# EAGLE design beeper (EAGLE 6.5.0)
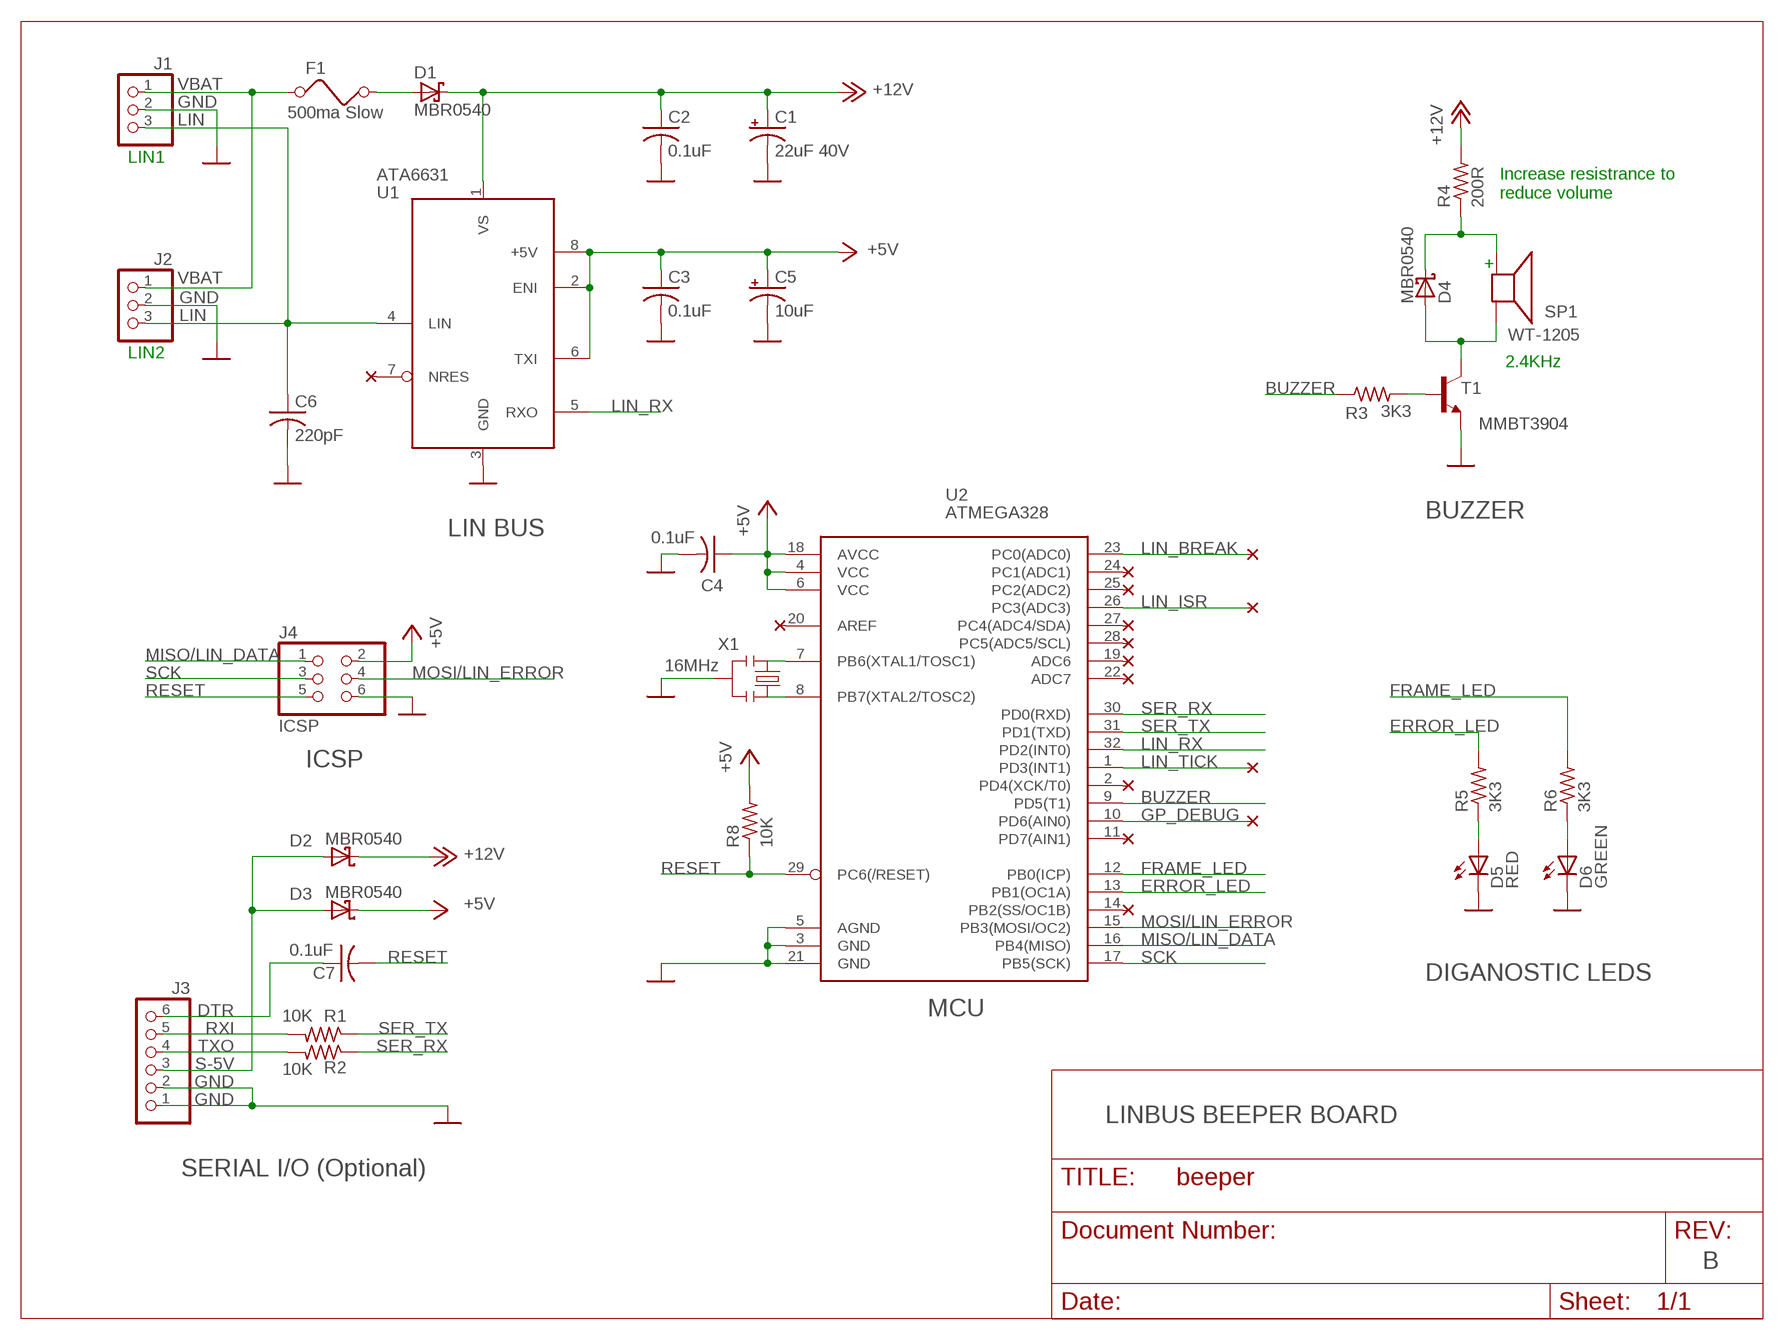
[diagram p0: schematic, sheet 1]

## Parts
C1  22uF 40V  CPOL-USUD-6,3X5,8  [UD-6,3X5,8_NICHICON]
C2  0.1uF  C-USC0805  [C0805]
C3  0.1uF  C-USC0805  [C0805]
C4  0.1uF  C-USC0805  [C0805]
C5  10uF  CPOL-USA/3216-18R  [A/3216-18R]
C6  220pF  C-USC0805  [C0805]
C7  0.1uF  C-USC0805  [C0805]
D1  MBR0540  SMF5.0AT1  [SOD123FL]
D2  MBR0540  SMF5.0AT1  [SOD123FL]
D3  MBR0540  SMF5.0AT1  [SOD123FL]
D4  MBR0540  SMF5.0AT1  [SOD123FL]
D5  RED  LED  [1206-LED]
D6  GREEN  LED  [1206-LED]
F1  500ma Slow  FUSE  [1206]
J1  PINHD-1X3  [1X03]
J2  PINHD-1X3  [1X03]
J3  PINHD-1X6  [1X06]
J4  ICSP  PINHD-2X3  [2X03]
R1  10K  R-US_R0805  [R0805]
R2  10K  R-US_R0805  [R0805]
R3  3K3  R-US_R0805  [R0805]
R4  200R  R-US_R0805  [R0805]
R5  3K3  R-US_R0805  [R0805]
R6  3K3  R-US_R0805  [R0805]
R8  10K  R-US_R0805  [R0805]
SP1  WT-1205  AL60P  [AL60P]
T1  MMBT3904  MMBT3904LT1-NPN-SOT23-BEC  [SOT23-BEC]
U1  ATA6631  [SO-08]
U2  ATMEGA328  [TQFP32-08]
X1  16MHz  RESONATORSMD  [RESONATOR-SMD]

## Nets
+5V: C3.1 C4.1 C5.+ D3.C J4.2 R8.2 U1.2(ENI) U1.6(TXI) U1.8(+5V) U2.4(VCC) U2.6(VCC) U2.18(AVCC)
+12V: C1.+ C2.1 D1.C D2.C R4.2 U1.1(VS)
BUZZER: R3.1 U2.9(PD5(T1))
DTR: C7.1 J3.6
ERROR_LED: R5.2 U2.13(PB1(OC1A))
FRAME_LED: R6.2 U2.12(PB0(ICP))
GND: C1.- C2.2 C3.2 C4.2 C5.- C6.2 D5.C D6.C J1.2 J2.2 J3.1 J3.2 J4.6 T1.E U1.3(GND) U2.3(GND) U2.5(AGND) U2.21(GND) X1.2
GP_DEBUG: U2.10(PD6(AIN0))
LIN: C6.1 J1.3 J2.3 U1.4(LIN)
LIN_BREAK: U2.23(PC0(ADC0))
LIN_ISR: U2.26(PC3(ADC3))
LIN_RX: U1.5(RXO) U2.32(PD2(INT0))
LIN_TICK: U2.1(PD3(INT1))
MISO/LIN_DATA: J4.1 U2.16(PB4(MISO))
MOSI/LIN_ERROR: J4.4 U2.15(PB3(MOSI/OC2))
N$3: D6.A R6.1
N$4: D5.A R5.1
N$6: D1.A F1.2
N$19: R3.2 T1.B
N$30: D4.C R4.1 SP1.1
N$31: D4.A SP1.2 T1.C
RESET: C7.2 J4.5 R8.1 U2.29(PC6(/RESET))
RXI: J3.5 R1.2
S-5V: D2.A D3.A J3.3
SCK: J4.3 U2.17(PB5(SCK))
SER_RX: R2.1 U2.30(PD0(RXD))
SER_TX: R1.1 U2.31(PD1(TXD))
TXO: J3.4 R2.2
VBAT: F1.1 J1.1 J2.1
XTAL1: U2.7(PB6(XTAL1/TOSC1)) X1.3
XTAL2: U2.8(PB7(XTAL2/TOSC2)) X1.1
Unconnected: U1.7(NRES) U2.2(PD4(XCK/T0)) U2.11(PD7(AIN1)) U2.14(PB2(SS/OC1B)) U2.19(ADC6) U2.20(AREF) U2.22(ADC7) U2.24(PC1(ADC1)) U2.25(PC2(ADC2)) U2.27(PC4(ADC4/SDA)) U2.28(PC5(ADC5/SCL))

## Notes on the sheet
- LIN1
- Increase resistrance to
  reduce volume
- +
- LIN2
- 2.4KHz
- BUZZER
- LIN BUS
- ICSP
- DIGANOSTIC LEDS
- MCU
- LINBUS BEEPER BOARD
- SERIAL I/O (Optional)
- B

## Library data of the parts
C1 C5 = beeper:CPOL-US
C2-C4 C6 C7 = beeper:C-US
D1-D4 = beeper:SMF5.0AT1
D5 D6 = beeper:LED
F1 = beeper:FUSE
J1 J2 = beeper:PINHD-1X3
J3 = beeper:PINHD-1X6
J4 = beeper:PINHD-2X3
R1-R6 R8 = beeper:R-US_
SP1 = beeper:AL60P; OC_FARNELL: unknown; OC_NEWARK: unknown
T1 = beeper:*-NPN-
U1 = beeper:ATA6631
U2 = beeper:ATMEGA328
X1 = beeper:RESONATOR

## Board
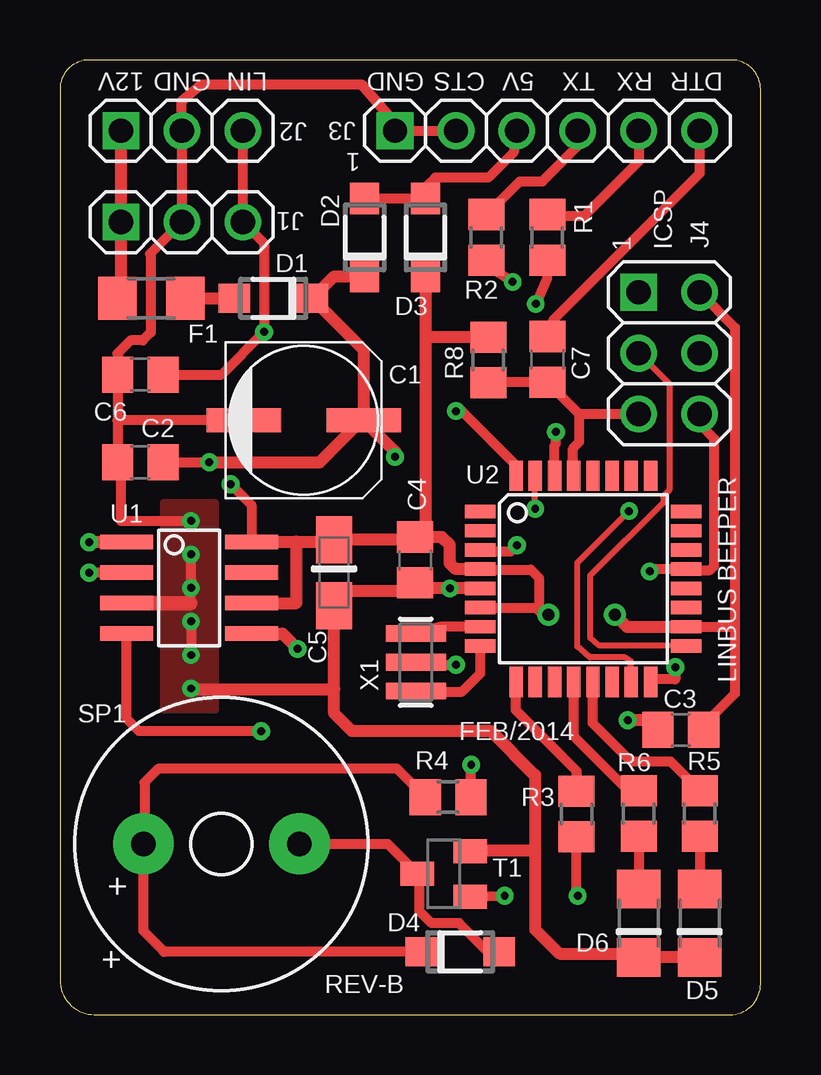
[diagram p1: board, top side]
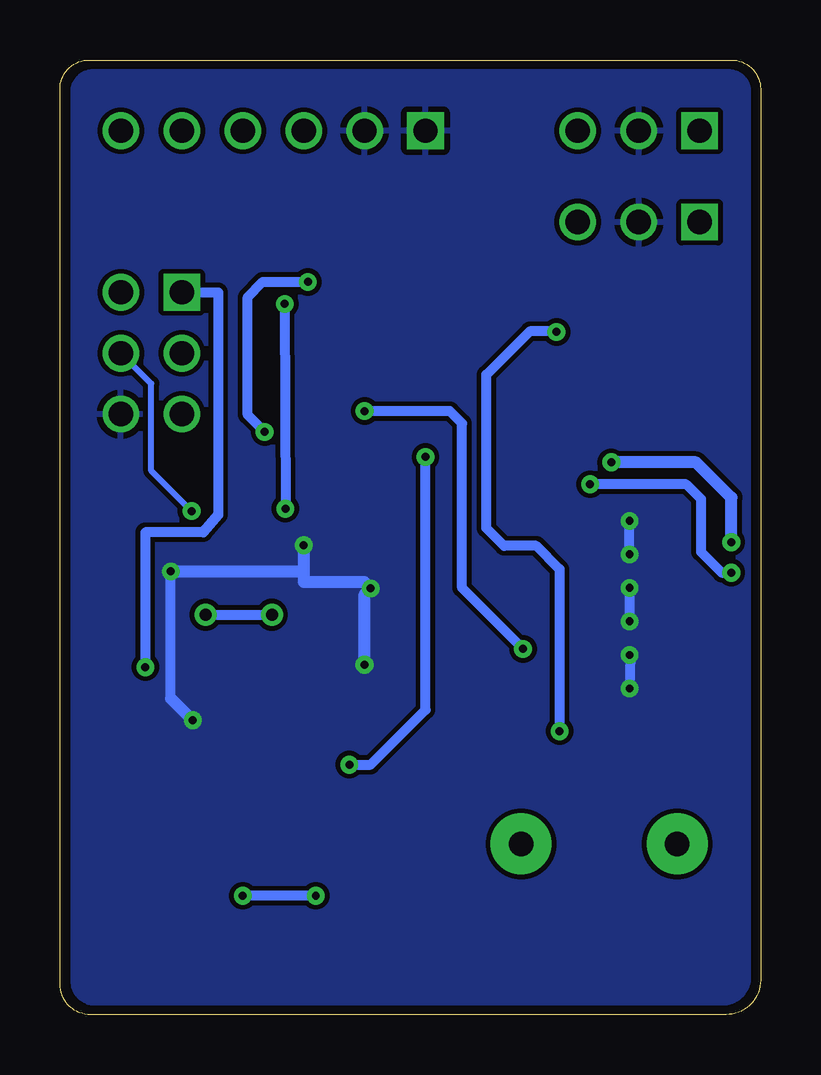
[diagram p2: board, bottom side, seen from below]

Size 29.21 x 39.78 mm. Coordinates in mm from the lower left corner, seen from the top.
Outline: 29.21,1.27 29.21,38.56 arc90 28,39.78 1.21,39.78 arc90 0,38.56 0,1.44 arc90 1.44,0 27.94,0 arc90 29.21,1.27
Copper layers (1*16): Top 0.035mm / dielectric 1.5mm / Bottom 0.035mm
Design rules "default *": minimum track width 10mil, minimum drill 13mil, track to track 8mil, track to pad 8mil, pad to pad 8mil, via to via 8mil, smd to smd 0mil, copper to edge 0mil, drill to drill 8mil, minimum pad ring 10mil, minimum via ring 8mil, stop-mask expansion 4mil, vias tented up to drill 20mil, thermal gap 10mil

### Footprints (pad centres in the part's own frame; a part is rotated, then mirrored left to right if it is on the bottom)
UD-6,3X5,8_NICHICON = smd 3.1 x 1: + 2.5,0; - -2.5,0
C0805 = smd 1.3 x 1.5: 1 -0.95,0; 2 0.95,0
A/3216-18R = smd 1.95 x 1.5: + 1.375,0; - -1.375,0
SOD123FL = smd 1.31 x 1.22: A 1.625,0; C -1.625,0
1206-LED = smd 1.6 x 1.803: A -1.422,0; C 1.422,0
1206 = smd 1.6 x 1.803: 1 -1.422,0; 2 1.422,0
1X03 = drill 1.016 square: 1 -2.54,0 | drill 1.016: 2 0,0; 3 2.54,0
1X06 = drill 1.016 square: 1 6.35,0 | drill 1.016: 2 3.81,0; 3 1.27,0; 4 -1.27,0; 5 -3.81,0; 6 -6.35,0
2X03 = drill 1.016 square: 1 -2.54,-1.27 | drill 1.016: 2 -2.54,1.27; 3 0,-1.27; 4 0,1.27; 5 2.54,-1.27; 6 2.54,1.27
R0805 = smd 1.3 x 1.5: 1 -0.95,0; 2 0.95,0
AL60P = drill 1.016 pad 2.54: 1 -3.251,0; 2 3.251,0
SOT23-BEC = smd 1 x 1.4: B -0.95,-1.1; C 0,1.1; E 0.95,-1.1
SO-08 = smd 0.6 x 2.2: 1 -1.905,-2.6; 2 -0.635,-2.6; 3 0.635,-2.6; 4 1.905,-2.6; 5 1.905,2.6; 6 0.635,2.6; 7 -0.635,2.6; 8 -1.905,2.6
TQFP32-08 = smd 1.27 x 0.559: 1 -4.293,2.8; 2 -4.293,2; 3 -4.293,1.2; 4 -4.293,0.4; 5 -4.293,-0.4; 6 -4.293,-1.2; 7 -4.293,-2; 8 -4.293,-2.8; 17 4.293,-2.8; 18 4.293,-2; 19 4.293,-1.2; 20 4.293,-0.4; 21 4.293,0.4; 22 4.293,1.2; 23 4.293,2; 24 4.293,2.8 | smd 0.559 x 1.27: 9 -2.8,-4.293; 10 -2,-4.293; 11 -1.2,-4.293; 12 -0.4,-4.293; 13 0.4,-4.293; 14 1.2,-4.293; 15 2,-4.293; 16 2.8,-4.293; 25 2.8,4.293; 26 2,4.293; 27 1.2,4.293; 28 0.4,4.293; 29 -0.4,4.293; 30 -1.2,4.293; 31 -2,4.293; 32 -2.8,4.293
RESONATOR-SMD = smd 0.7 x 2.5: 1 -1.2,0; 2 0,0; 3 1.2,0

### Placement (x,y rotation side)
C1  10.16,24.77 0 top
C2  3.35,23.01 180 top
C3  25.88,11.86 180 top
C4  14.81,18.95 270 top
C5  11.43,18.41 90 top
C6  3.35,26.67 180 top
C7  20.32,27.3 270 top
D1  8.89,29.84 180 top
D2  12.7,32.38 90 top
D3  15.24,32.38 90 top
D4  16.69,2.62 0 top
D5  26.67,3.81 270 top
D6  24.13,3.81 270 top
F1  3.81,29.84 0 top
J1  5.08,33.02 0 top
J2  5.08,36.83 0 top
J3  20.32,36.83 180 top
J4  25.4,27.56 270 top
R1  20.32,32.38 90 top
R2  17.78,32.38 90 top
R3  21.54,8.36 270 top
R4  16.18,9.07 0 top
R5  26.67,8.38 90 top
R6  24.13,8.38 90 top
R8  17.86,27.28 90 top
SP1  6.73,7.11 0 top
T1  16,5.87 90 top
U1  5.38,17.78 270 top
U2  21.82,18.16 0 top
X1  14.83,14.68 90 top

### Tracks (layer width: path | path; a pad name or v marks a point on that pad's centre or on a via)
+5V  (via drill 0.33, 0.51)
  Top 0.254: 8.01,19.71 U1.8 7.87,19.56 7.11,19.56 7.09,19.66 | 15.24,30.73 D3.C | 15.19,20.37 15.24,20.32 14.99,20.07 C4.1 | 10.85,19.71 10.92,19.81 11.43,19.81 C5.+
  Top 0.406: J4.2 28.14,28.63 28.14,16.15 | 28.14,16.15 28.14,13.38 26.83,12.06 C3.1 | U2.4 17.55,18.54 19.63,18.54 19.96,18.21 19.96,16.99 19.93,16.96 U2.6 | U2.18 26.17,16.1 26.22,16.15 28.14,16.15 | U1.2 v1.22,18.41 | v7.11,22.1 7.99,21.23 U1.8 | C5.+ 11.45,19.81 | 14.22,19.81 14.31,19.9 C4.1
  Top 0.508: 8.01,19.71 9.86,19.71 | 9.86,19.71 10.85,19.71 | 9.86,19.71 9.86,17.14 U1.6 | U2.4 16.49,18.56 16.26,18.8 16.26,19.56 15.92,19.9 C4.1 15.24,20.33 15.24,28.23 | 15.24,30.73 15.24,28.23 | R8.2 15.24,28.23 | 11.45,19.81 14.22,19.81 | 19.93,16.96 20.23,16.66 v20.37,16.66 | v23.14,16.66 23.64,16.16 U2.18
  Bottom 0.406: v23.14,16.66 v20.37,16.66 | v1.22,18.41 1.63,18.41 2.49,19.28 2.49,21.49 3.1,22.1 v7.11,22.1
+12V  (via drill 0.33)
  Top 0.254: 12.51,24.7 C1.+
  Top 0.406: C2.1 v6.22,23.01 | R4.2 17.14,9.07 v17.14,10.41
  Top 0.508: D2.C 11.43,30.76 D1.C 12.66,27.7 C1.+ 13.97,23.45 v13.97,23.24 | v6.22,23.01 10.82,23.01 12.51,24.7 | U1.1 v1.22,19.68
  Bottom 0.406: v17.14,10.41 16.26,10.41 13.97,12.7 v13.97,23.24
  Bottom 0.508: v1.22,19.68 1.22,21.54 2.69,23.01 v6.22,23.01
BUZZER
  Top 0.406: U2.9 19,13.85 19,12.7 21.54,10.16 R3.1
DTR
  Top 0.254: 20.57,28.45 C7.1
  Top 0.406: 20.57,28.45 20.57,28.96 26.67,35.05 J3.6
ERROR_LED
  Top 0.406: R5.2 25.46,10.54 23.82,10.54 22.22,12.15 U2.13
FRAME_LED
  Top 0.406: R6.2 23.69,9.33 21.42,11.6 U2.12
GND  (via drill 0.33)
  Top 0.254: 15.05,17.76 C4.2 14.81,17.93 | 3.76,31.7 3.79,31.67 | U2.3 17.58,19.3 | U2.21 26.16,18.52 | 2.08,17.17 2.54,17.27 U1.3 | 2.29,22.86 C2.2 | 11.43,17.02 C5.-
  Top 0.406: J3.2 J3.1 13.97,37.13 12.57,38.76 5.89,38.76 5.08,38.08 J2.2 J1.2 3.76,31.7 | 3.79,31.67 3.79,28.42 3.45,28.09 2.95,28.09 2.4,27.55 C6.2 2.4,24.77 | 2.4,24.77 C2.2 | C1.- 2.4,24.77 | 26.16,18.52 26.64,18.52 | 26.64,18.52 27.1,18.52 27.28,18.69 27.28,24 26.67,24.61 J4.6 | v24.59,18.47 24.69,18.57 26.59,18.57 26.64,18.52 | U2.21 26.6,18.56 26.62,18.54 | 2.29,22.86 2.54,22.86 2.54,20.57 v5.46,20.57 | v5.46,19.18 5.44,19.18 v5.46,17.78 5.44,17.14 | v5.46,16.38 v5.46,14.99 | X1.2 15.54,14.58 v16.51,14.58 | 17.58,19.3 18.8,19.3 v19.05,19.56 | 24.13,2.54 D6.C | C3.2 24.53,12.27 | 11.56,17.04 11.68,17.16 11.68,17.65 | 14.86,17.65 14.86,18.03
  Top 0.508: U2.5 v16.26,17.76 15.05,17.76 | D5.C D6.C | 11.43,13.56 11.43,17.02 | C5.- 11.56,17.04 | 19.81,6.86 19.81,9.98 17.98,11.81 12.17,11.81 11.43,12.55 11.43,13.56 | 19.81,6.86 19.81,3.56 20.83,2.54 24.13,2.54 | 24.53,12.27 v23.67,12.27 | T1.E 17.14,6.86 19.81,6.86 | 11.68,17.65 14.86,17.65 | v5.46,13.59 5.49,13.56 11.43,13.56
  Top 0.61: U1.3 5.44,17.14
  Bottom 0.406: 5.46,20.5 v5.46,20.57 v5.46,19.18 | v5.46,17.78 v5.46,16.38 | v5.46,14.99 5.44,14.94 v5.46,13.59 | 19.13,18.47 19.05,18.54 | 24.59,13.18 v24.59,18.47
  Bottom 0.508: v16.51,14.58 16.51,17.51 v16.26,17.76 16.53,18.03 19.05,18.03 19.05,18.54 v19.05,19.56 | v24.59,18.47 19.13,18.47 | v23.67,12.27 24.59,13.18
  pour Top: 4.32,21.34 4.32,12.7 6.48,12.7 6.48,21.34
  pour Bottom: 3.43,21.34 3.43,12.7 7.37,12.7 7.37,21.34
  pour Bottom (rank 6): 28.65,38.45 28.65,1.4 arc-90 27.76,0.51 1.59,0.51 arc-90 0.51,1.59 0.51,38.44 arc-90 1.34,39.27 27.83,39.27 arc-90
LIN  (via drill 0.33)
  Top 0.406: J2.3 J1.3 8.51,32.13 v8.51,28.45 6.73,26.67 C6.1 | 2.76,15.85 U1.4 2.79,12.33 3.3,11.81 v8.38,11.81
  Bottom 0.406: v8.38,11.81 8.38,18.57 9.35,19.53 10.69,19.53 11.43,20.27 11.43,26.67 9.63,28.47 8.53,28.47 v8.51,28.45
LIN_RX  (via drill 0.33)
  Top 0.406: v16.51,25.15 16.76,25.15 19.02,22.89 U2.32
  Top 0.508: U1.5 9.27,15.88 v9.91,15.24
  Bottom 0.406: v9.91,15.24 12.45,17.78 12.45,24.64 12.95,25.15 v16.51,25.15
MISO/LIN_DATA  (via drill 0.33)
  Top 0.254: 24.64,13.97 U2.16
  Top 0.406: 24.64,13.97 25.65,13.97 v25.65,14.48
  Bottom 0.406: v25.65,14.48 25.65,20.09 23.24,20.09 22.61,20.83 22.61,30.1 J4.1
MOSI/LIN_ERROR  (via drill 0.33)
  Top 0.254: U2.15 23.8,13.89 23.8,14.73 23.55,14.88 22.1,14.88 21.57,15.34 21.57,18.82 v23.72,20.98
  Bottom 0.254: v23.72,20.98 25.4,22.66 25.4,26.29 J4.4
N$3
  Top 0.406: R6.1 D6.A
N$4
  Top 0.406: R5.1 D5.A
N$6
  Top 0.508: F1.2 D1.A
N$19  (via drill 0.33)
  Top 0.406: T1.B 18.34,4.95 v18.54,4.95 | v21.59,4.95 21.54,5 R3.2
  Bottom 0.406: v18.54,4.95 v21.59,4.95
N$30
  Top 0.406: D4.C 4.34,2.62 3.48,3.48 SP1.1 3.53,7.16 3.53,9.68 4.12,10.26 14.04,10.26 R4.1
N$31
  Top 0.406: D4.A 17.83,2.62 16.64,3.81 15.49,3.81 14.99,4.32 14.99,5.78 T1.C 13.66,7.11 SP1.2
RESET
  Top 0.254: U2.29
  Top 0.406: J4.5 21.66,25.02 | 21.66,25.02 C7.2 17.88,26.36 R8.1 | U2.29 21.39,22.48 21.39,23.6 21.66,23.87 21.66,25.02
RXI
  Top 0.254: 20.32,33.53 R1.2
  Top 0.406: J3.5 24.13,35.56 21.84,33.27 20.38,33.27 R1.2
S-5V
  Top 0.254: D2.A 12.7,34.29 12.98,34.01 | 15.24,34.47 D3.A
  Top 0.406: 12.98,34.01 D3.A | J3.3 18.92,36.7 18.92,35.94 17.86,34.87 15.65,34.87 15.24,34.47
SCK
  Top 0.254: J4.3 25.4,26.29 25.4,21.84 25.15,21.59 25.15,21.34 22.1,18.29 22.1,15.7 22.45,15.39 25.91,15.39 U2.17
SER_RX  (via drill 0.33)
  Top 0.254: 20.57,22.35 U2.30 | 17.78,31.24 R2.1
  Top 0.406: 17.78,31.24 v18.87,30.53 | U2.30 20.62,23.72 20.68,23.77 v20.68,24.28
  Bottom 0.406: v20.68,24.28 21.39,24.99 21.39,29.9 20.75,30.53 v18.87,30.53
SER_TX  (via drill 0.33)
  Top 0.254: v19.81,21.08 19.81,22.35 U2.31 | R1.1 20.32,30.73
  Top 0.406: 20.32,30.73 v19.84,29.62
  Bottom 0.406: v19.84,29.62 v19.81,21.08
TXO
  Top 0.406: R2.2 19.17,34.72 20.12,34.72 21.59,36.2 J3.4
VBAT
  Top 0.254: 2.54,29.97 F1.1
  Top 0.508: J2.1 J1.1 2.54,29.97
XTAL1
  Top 0.406: U2.7 15.88,16.16 X1.3
XTAL2
  Top 0.254: U2.8 17.53,15.24
  Top 0.406: X1.1 14.85,13.46 16.76,13.46 17.53,14.22 U2.8

### Text on the board
tPlace: 12V | GND | LIN | GND | CTS | 5V | TX | RX | DTR | 1 | 1 | ICSP | LINBUS BEEPER | FEB/2014 | + | + | REV-B
bStop: LINBUS BEEPER - REV B